# Altium schematic sheet rover_sch.SchDoc: Hack Rover
size 381 x 241 mm; Date: 7/26/2024; Author: Brian Tan; CompanyName: Rover the Moon; Revision: A; SheetNumber: 1; SheetTotal: 1
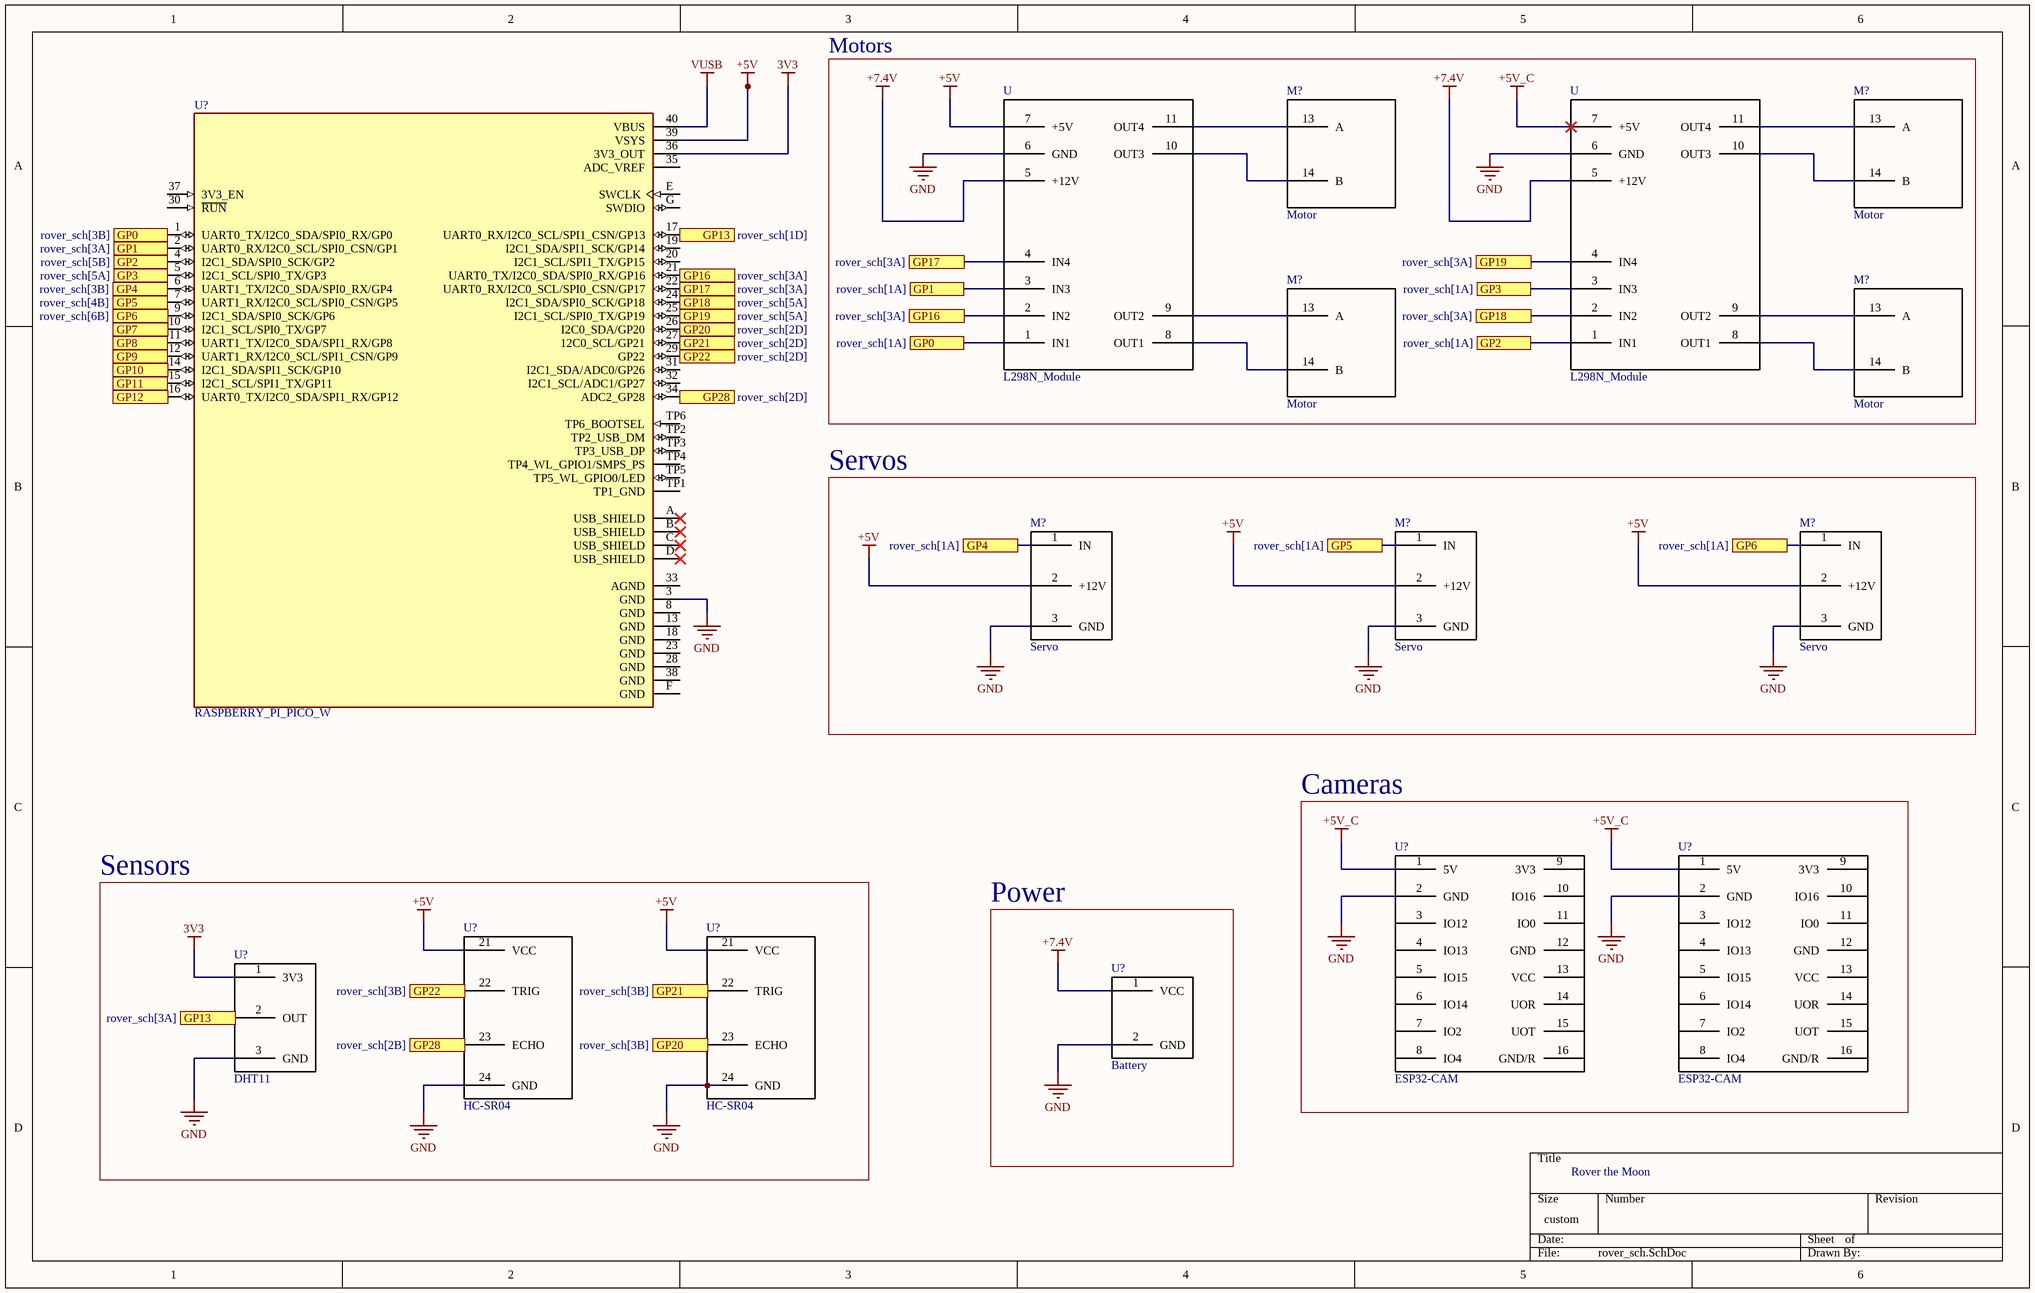
[diagram p0: rover_sch.SchDoc]

## Parts
(Parts that share a designator on the sheet are numbered #1, #2 ... from top to bottom, then left to right.)
M?#1  Motor
M?#2  Motor
M?#3  Motor
M?#4  Motor
M?#5  Servo
M?#6  Servo
M?#7  Servo
U#1  L298N_Module
U#2  L298N_Module
U?#1  RASPBERRY_PI_PICO_W  [MODULE_RASPBERRY_PI_PICO_W]
U?#2  ESP32-CAM
U?#3  ESP32-CAM
U?#4  DHT11
U?#5  HC-SR04
U?#6  HC-SR04
U?#7  Battery

## Blocks framed on the sheet
Motors: M?#1-M?#4 U#1 U#2
Servos: M?#5-M?#7
Cameras: U?#2 U?#3
Sensors: U?#4-U?#6
Power: U?#7

## Ports
GP0 (see rover_sch[1A]), GP0 (see rover_sch[3B]), GP1 (see rover_sch[1A]), GP1 (see rover_sch[3A]), GP2 (see rover_sch[1A]), GP2 (see rover_sch[5B]), GP3 (see rover_sch[1A]), GP3 (see rover_sch[5A]), GP4 (see rover_sch[1A]), GP4 (see rover_sch[3B]), GP5 (see rover_sch[1A]), GP5 (see rover_sch[4B]), GP6 (see rover_sch[1A]), GP6 (see rover_sch[6B]), GP7, GP8, GP9, GP10, GP11, GP12, GP13 (see rover_sch[1D]), GP13 (see rover_sch[3A]), GP16 (see rover_sch[3A]), GP17 (see rover_sch[3A]), GP18 (see rover_sch[3A]), GP18 (see rover_sch[5A]), GP19 (see rover_sch[3A]), GP19 (see rover_sch[5A]), GP20 (see rover_sch[2D]), GP20 (see rover_sch[3B]), GP21 (see rover_sch[2D]), GP21 (see rover_sch[3B]), GP22 (see rover_sch[2D]), GP22 (see rover_sch[3B]), GP28 (see rover_sch[2B]), GP28 (see rover_sch[2D])

## Nets
3V3: U?#1.36(3V3_OUT) U?#4.1(3V3)
+5V: M?#5.2(+12V) M?#6.2(+12V) M?#7.2(+12V) U#1.7(+5V) U?#1.39(VSYS) U?#5.21(VCC) U?#6.21(VCC)
+5V_C: U#2.7(+5V) U?#2.1(5V) U?#3.1(5V)
+7.4V: U#1.5(+12V) U#2.5(+12V) U?#7.1(VCC)
GND: M?#5.3(GND) M?#6.3(GND) M?#7.3(GND) U#1.6(GND) U#2.6(GND) U?#1.3(GND) U?#2.2(GND) U?#3.2(GND) U?#4.3(GND) U?#5.24(GND) U?#6.24(GND) U?#7.2(GND)
VUSB: U?#1.40(VBUS)
GP0: U#1.1(IN1) U?#1.1(UART0_TX/I2C0_SDA/SPI0_RX/GP0) ; port GP0
GP1: U#1.3(IN3) U?#1.2(UART0_RX/I2C0_SCL/SPI0_CSN/GP1) ; port GP1
GP2: U#2.1(IN1) U?#1.4(I2C1_SDA/SPI0_SCK/GP2) ; port GP2
GP3: U#2.3(IN3) U?#1.5(I2C1_SCL/SPI0_TX/GP3) ; port GP3
GP4: M?#5.1(IN) U?#1.6(UART1_TX/I2C0_SDA/SPI0_RX/GP4) ; port GP4
GP5: M?#6.1(IN) U?#1.7(UART1_RX/I2C0_SCL/SPI0_CSN/GP5) ; port GP5
GP6: M?#7.1(IN) U?#1.9(I2C1_SDA/SPI0_SCK/GP6) ; port GP6
GP7: U?#1.10(I2C1_SCL/SPI0_TX/GP7) ; port GP7
GP8: U?#1.11(UART1_TX/I2C0_SDA/SPI1_RX/GP8) ; port GP8
GP9: U?#1.12(UART1_RX/I2C0_SCL/SPI1_CSN/GP9) ; port GP9
GP10: U?#1.14(I2C1_SDA/SPI1_SCK/GP10) ; port GP10
GP11: U?#1.15(I2C1_SCL/SPI1_TX/GP11) ; port GP11
GP12: U?#1.16(UART0_TX/I2C0_SDA/SPI1_RX/GP12) ; port GP12
GP13: U?#1.17(UART0_RX/I2C0_SCL/SPI1_CSN/GP13) U?#4.2(OUT) ; port GP13
GP16: U#1.2(IN2) U?#1.21(UART0_TX/I2C0_SDA/SPI0_RX/GP16) ; port GP16
GP17: U#1.4(IN4) U?#1.22(UART0_RX/I2C0_SCL/SPI0_CSN/GP17) ; port GP17
GP18: U#2.2(IN2) U?#1.24(I2C1_SDA/SPI0_SCK/GP18) ; port GP18
GP19: U#2.4(IN4) U?#1.25(I2C1_SCL/SPI0_TX/GP19) ; port GP19
GP20: U?#1.26(I2C0_SDA/GP20) U?#6.23(ECHO) ; port GP20
GP21: U?#1.27(12C0_SCL/GP21) U?#6.22(TRIG) ; port GP21
GP22: U?#1.29(GP22) U?#5.22(TRIG) ; port GP22
GP28: U?#1.34(ADC2_GP28) U?#5.23(ECHO) ; port GP28
NetM?#1_13: M?#1.13(A) U#1.11(OUT4)
NetM?#1_14: M?#1.14(B) U#1.10(OUT3)
NetM?#2_13: M?#2.13(A) U#2.11(OUT4)
NetM?#2_14: M?#2.14(B) U#2.10(OUT3)
NetM?#3_13: M?#3.13(A) U#1.9(OUT2)
NetM?#3_14: M?#3.14(B) U#1.8(OUT1)
NetM?#4_13: M?#4.13(A) U#2.9(OUT2)
NetM?#4_14: M?#4.14(B) U#2.8(OUT1)

Not connected (* = marked no-connect by the designer): U?#1 8(GND) 13(GND) 18(GND) 19(I2C1_SDA/SPI1_SCK/GP14) 20(I2C1_SCL/SPI1_TX/GP15) 23(GND) 28(GND) 30(~{RUN}) 31(I2C1_SDA/ADC0/GP26) 32(I2C1_SCL/ADC1/GP27) 33(AGND) 35(ADC_VREF) 37(3V3_EN) 38(GND) A(USB_SHIELD)* B(USB_SHIELD)* C(USB_SHIELD)* D(USB_SHIELD)* E(SWCLK) F(GND) G(SWDIO) TP1(TP1_GND) TP2(TP2_USB_DM) TP3(TP3_USB_DP) TP4(TP4_WL_GPIO1/SMPS_PS) TP5(TP5_WL_GPIO0/LED) TP6(TP6_BOOTSEL); U?#2 3(IO12) 4(IO13) 5(IO15) 6(IO14) 7(IO2) 8(IO4) 9(3V3) 10(IO16) 11(IO0) 12(GND) 13(VCC) 14(UOR) 15(UOT) 16(GND/R); U?#3 3(IO12) 4(IO13) 5(IO15) 6(IO14) 7(IO2) 8(IO4) 9(3V3) 10(IO16) 11(IO0) 12(GND) 13(VCC) 14(UOR) 15(UOT) 16(GND/R)

## Notes on the sheet
- Rover the Moon

## Library data of the parts
M?#1-M?#4 = CMP-007-000000-1: Source: Motor.SchLib; Design Item ID: Motor
M?#5-M?#7 = CMP-013-000000-1: Design Item ID: Servo; Source: Servo.SchLib
U#1 U#2 = CMP-005-000002-1: Design Item ID: L298N_Module; Source: L298N.SchLib
U?#1 = RASPBERRY_PI_PICO_W: Raspberry Pi Board, Arm Cortex-M0+; Silicon Manufacturer:Raspberry Pi; No. Of Bits:32Bit; Silicon Family Name:-; Core Architecture:Arm; Core Sub-Architecture:Cortex-M0+; Silicon Core Number:Rp2040; Product Range:Raspberry Pi Pico Rohs Compliant: Yes |Raspberry-Pi RASPBERRY PI PICO W; SnapEDA_Link: https://www.snapeda.com/parts/RASPBERRY%20PI%20PICO%20W/Raspberry+Pi/view-part/?ref=snap; Package: None; Value: *; MF: Raspberry Pi; MP: RASPBERRY PI PICO W; Check_prices: https://www.snapeda.com/parts/RASPBERRY%20PI%20PICO%20W/Raspberry+Pi/view-part/?ref=eda
U?#2 U?#3 = CMP-021-000000-1: Source: ESP32-CAM.SchLib; Design Item ID: ESP32-CAM
U?#4 = CMP-017-000000-1: Design Item ID: DHT11; Source: DHT11.SchLib
U?#5 U?#6 = CMP-015-000000-1: Design Item ID: HC-SR04; Source: HC-SR04.SchLib
U?#7 = CMP-00029-00001-1: Design Item ID: Battery; Source: Battery.SchLib